# EAGLE design lcd (EAGLE 5.11)
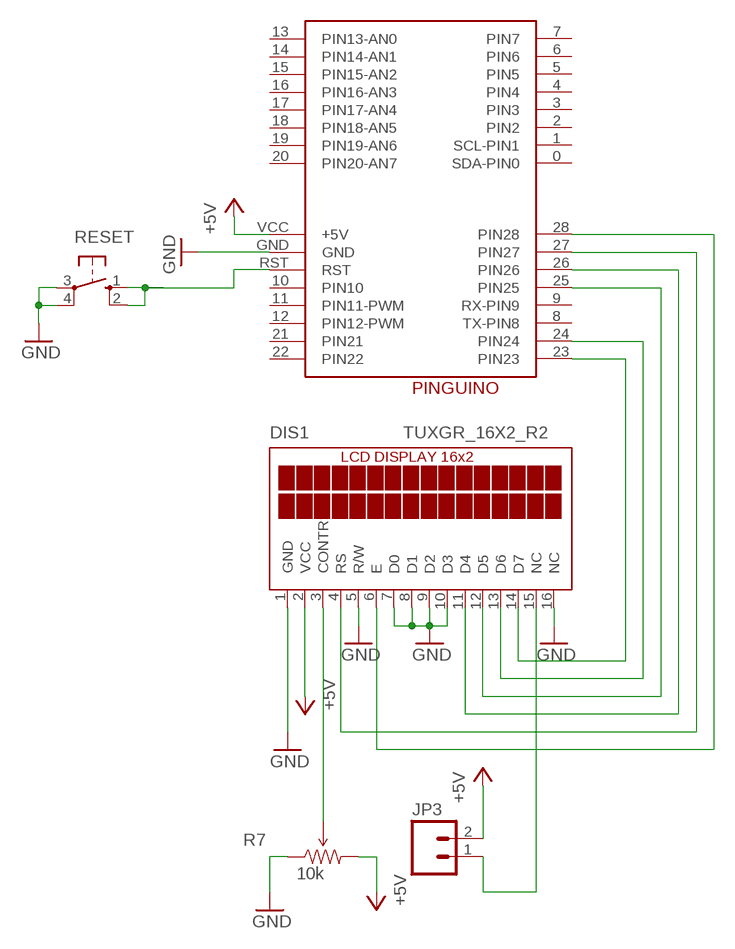
[diagram p0: schematic, sheet 1]

## Parts
DIS1  TUXGR_16X2_R2  [TUXGR_16X2_R2]
JP3  M02LOCK_LONGPADS  [1X02_LOCK_LONGPADS]
PINGUINO  PINGUINOBASE  PINGUINOBASEORIGINAL  [PINGUINOBASE]
R7  10k  TRIMPOTPTH  [TRIM_POT_PTH]
RESET  10-XX  [B3F-10XX]

## Nets
+5V: DIS1.2(VCC) JP3.2 PINGUINO.VCC(+5V) R7.3(CW)
GND: DIS1.1(GND) DIS1.5(R/W) DIS1.7(D0) DIS1.8(D1) DIS1.9(D2) DIS1.10(D3) DIS1.16(NC) PINGUINO.GND R7.1(CCW) RESET.3(P) RESET.4(P1)
N$1: DIS1.14(D7) PINGUINO.23(PIN23)
N$2: DIS1.13(D6) PINGUINO.24(PIN24)
N$3: DIS1.12(D5) PINGUINO.25(PIN25)
N$4: DIS1.11(D4) PINGUINO.26(PIN26)
N$9: DIS1.3(CONTR) R7.2(WIPER)
N$10: DIS1.4(RS) PINGUINO.27(PIN27)
N$11: DIS1.15(NC) JP3.1
N$12: DIS1.6(E) PINGUINO.28(PIN28)
RST: PINGUINO.RST RESET.1(S) RESET.2(S1)
Unconnected: PINGUINO.0(SDA-PIN0) PINGUINO.1(SCL-PIN1) PINGUINO.2(PIN2) PINGUINO.3(PIN3) PINGUINO.4(PIN4) PINGUINO.5(PIN5) PINGUINO.6(PIN6) PINGUINO.7(PIN7) PINGUINO.8(TX-PIN8) PINGUINO.9(RX-PIN9) PINGUINO.10(PIN10) PINGUINO.11(PIN11-PWM) PINGUINO.12(PIN12-PWM) PINGUINO.13(PIN13-AN0) PINGUINO.14(PIN14-AN1) PINGUINO.15(PIN15-AN2) PINGUINO.16(PIN16-AN3) PINGUINO.17(PIN17-AN4) PINGUINO.18(PIN18-AN5) PINGUINO.19(PIN19-AN6) PINGUINO.20(PIN20-AN7) PINGUINO.21(PIN21) PINGUINO.22(PIN22)

## Library data of the parts
DIS1 = display-lcd:TUXGR_16X2_R2: Tuxgraphics LCD display 16x2 characters reflective, without background light Source: tuxgr_12x2_r2.pdf; OC_FARNELL: unknown; OC_NEWARK: unknown
JP3 = SparkFun:M02: Header 2 Standard 2-pin 0.1" header. Use with straight break away headers (SKU : PRT-00116), right angle break away headers (PRT-00553), swiss pins (PRT-00743), machine pins (PRT-00117), and female headers (PRT-00115). Molex polarized connector foot print use with SKU : PRT-08233 with associated crimp pins and housings.
PINGUINO = PinguinoBase:PINGUINOBASE: Pinguino Base: Placa de desarrollo para Pinguino pic
R7 = SparkFun:TRIMPOT
RESET = switch-omron:10-XX: OMRON SWITCH; MPN: B3F-1000; OC_FARNELL: 176432; OC_NEWARK: 36M3542

## Board
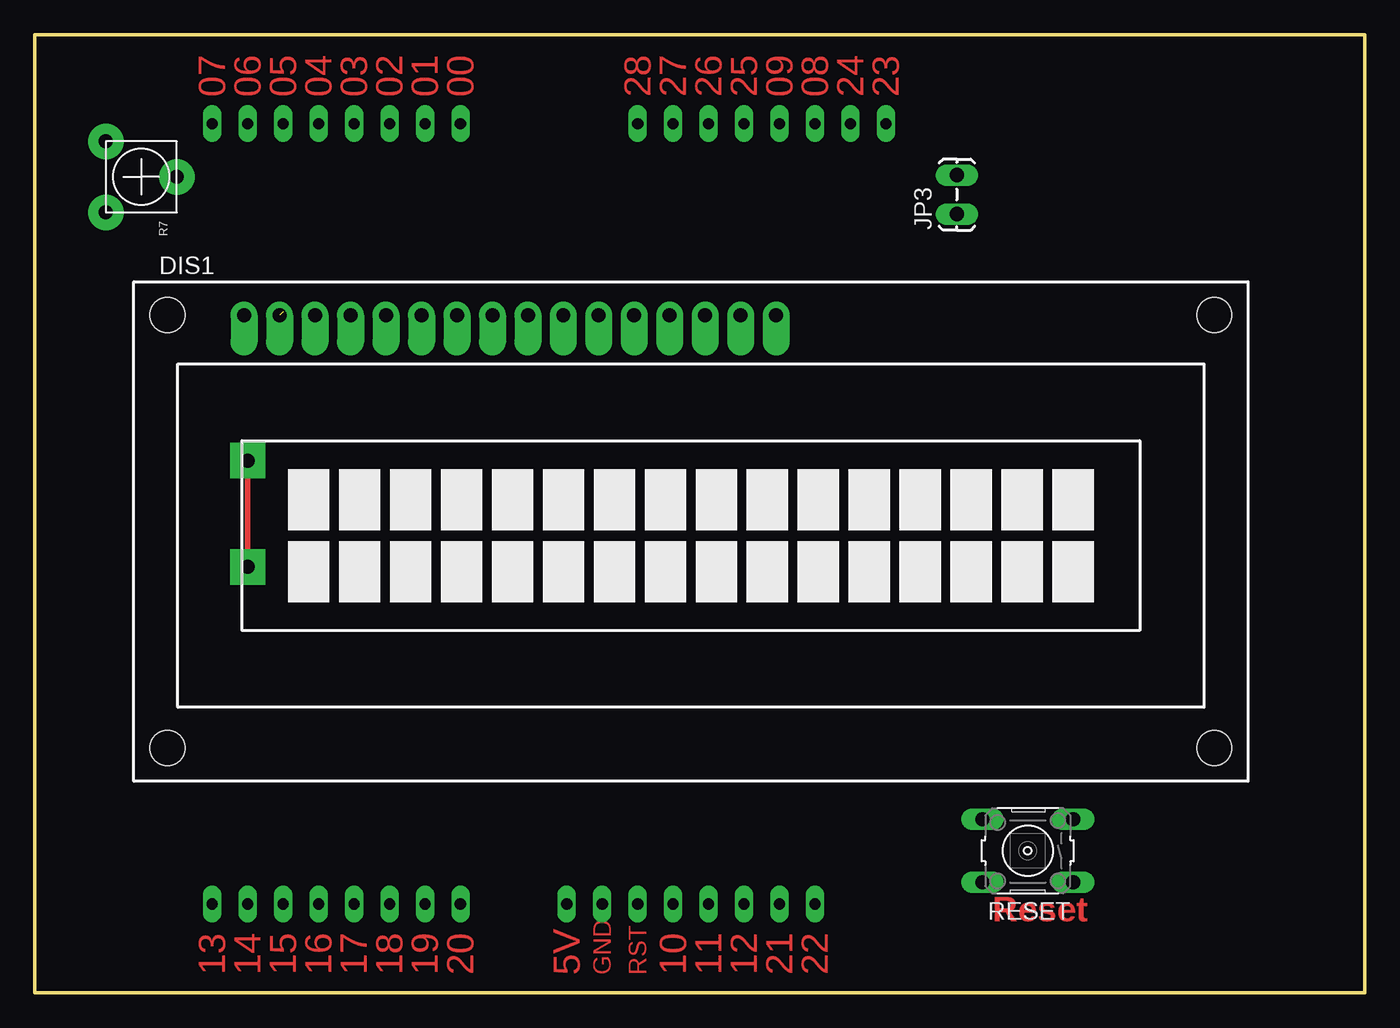
[diagram p1: board, top side]
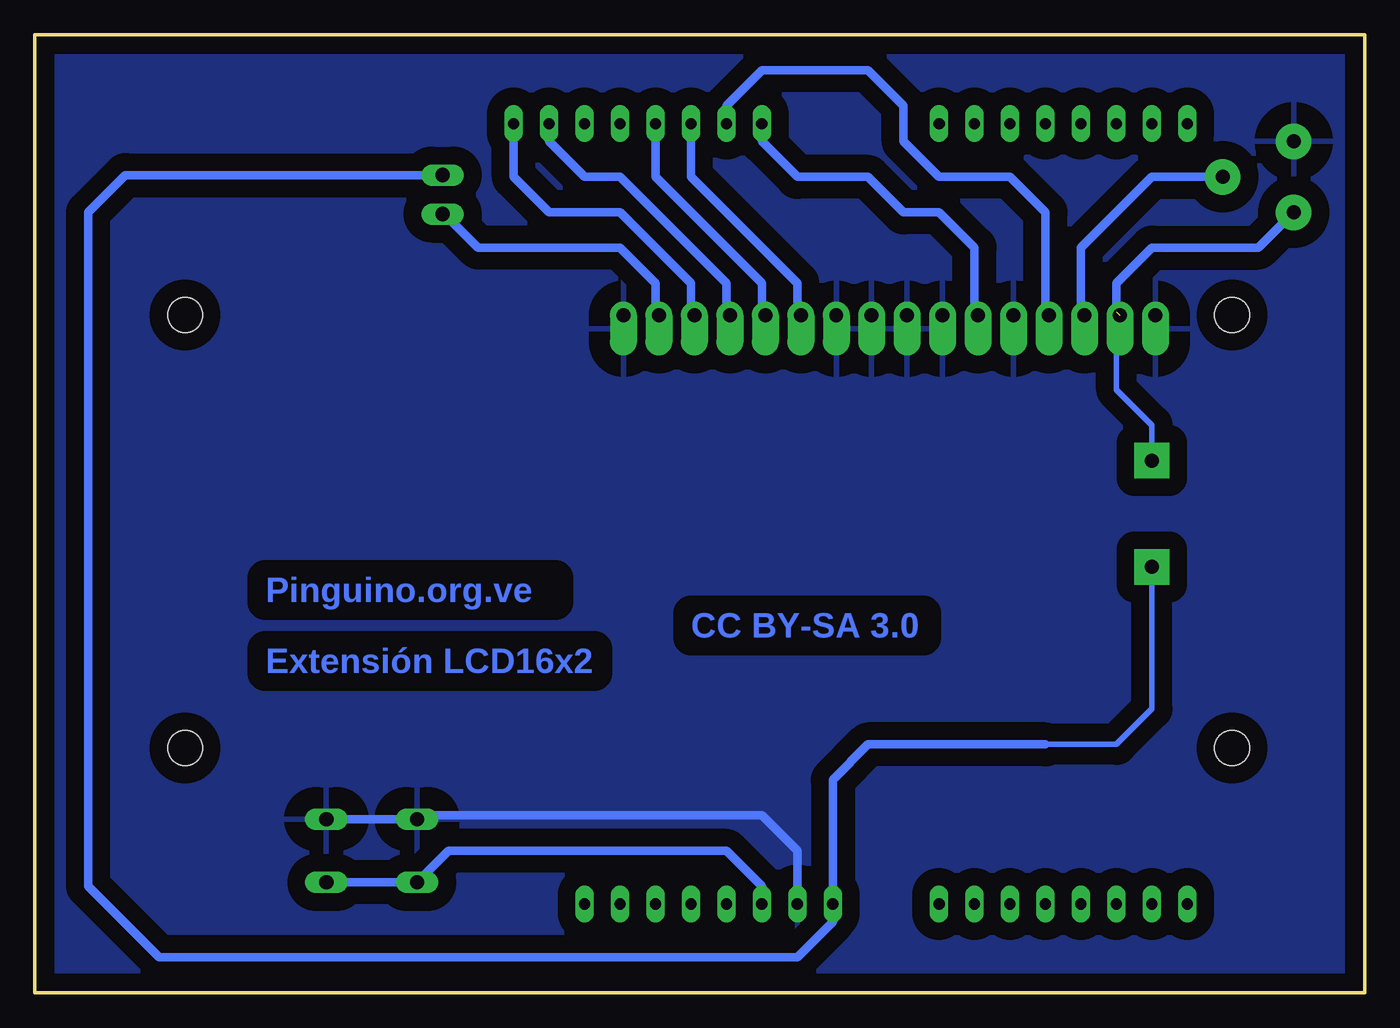
[diagram p2: board, bottom side, seen from below]

Size 95.25 x 68.58 mm. Coordinates in mm from the lower left corner, seen from the top.
Copper layers (1*16): Top 0.035mm / dielectric 1.5mm / Bottom 0.035mm
Design rules "default *": minimum track width 10mil, minimum drill 24mil, track to track 8mil, track to pad 8mil, pad to pad 8mil, via to via 8mil, smd to smd 8mil, copper to edge 40mil, drill to drill 8mil, minimum pad ring 10mil, minimum via ring 20mil, stop-mask expansion 4mil, vias tented up to drill 0mil, thermal gap 60mil

### Footprints (pad centres in the part's own frame; a part is rotated, then mirrored left to right if it is on the bottom)
TUXGR_16X2_R2 = drill 1 pad 1.93 offset: 1 -32,15.5; 2 -29.46,15.5; 3 -26.92,15.5; 4 -24.38,15.5; 5 -21.84,15.5; 6 -19.3,15.5; 7 -16.76,15.5; 8 -14.22,15.5; 9 -11.68,15.5; 10 -9.14,15.5; 11 -6.6,15.5; 12 -4.06,15.5; 13 -1.52,15.5; 14 1.02,15.5; 15 3.56,15.5; 16 6.1,15.5 | hole 2.5: -37.5,-15.5; 37.5,-15.5; -37.5,15.5; 37.5,15.5
1X02_LOCK_LONGPADS = drill 1.016 long: 1 -0.127,0; 2 2.667,0
PINGUINOBASE = drill 0.8 long: 0 64.77,6.35; 1 67.31,6.35; 2 69.85,6.35; 3 72.39,6.35; 4 74.93,6.35; 5 77.47,6.35; 6 80.01,6.35; 7 82.55,6.35; 8 39.37,6.35; 9 41.91,6.35; 10 49.53,62.23; 11 46.99,62.23; 12 44.45,62.23; 13 82.55,62.23; 14 80.01,62.23; 15 77.47,62.23; 16 74.93,62.23; 17 72.39,62.23; 18 69.85,62.23; 19 67.31,62.23; 20 64.77,62.23; 21 41.91,62.23; 22 39.37,62.23; 23 34.29,6.35; 24 36.83,6.35; 25 44.45,6.35; 26 46.99,6.35; 27 49.53,6.35; 28 52.07,6.35; GND 54.61,62.23; RST 52.07,62.23; VCC 57.15,62.23
TRIM_POT_PTH = drill 1 pad 2.54 round: 1 -2.54,-2.54; 2 0,2.54; 3 2.54,-2.54
B3F-10XX = drill 1.016 long: 1 -3.251,2.261; 2 3.251,2.261; 3 -3.251,-2.261; 4 3.251,-2.261

### Placement (x,y rotation side)
DIS1  46.99,33.02 0 top
JP3  66.04,55.88 90 top
PINGUINO  95.25,68.58 180 top
R7  7.62,58.42 270 top
RESET  71.12,10.16 180 top

### Tracks (layer width: path | path; a pad name or v marks a point on that pad's centre or on a via)
+5V  (via drill 1 pad 2.54)  (1 unrouted)
  Top 0.406: v15.24,30.48 v15.24,38.1
  Bottom 0.406: 22.86,17.78 17.78,17.78 15.24,20.32 v15.24,30.48 | v15.24,38.1 15.24,40.64 17.78,43.18 17.78,48.77
  Bottom 0.61: JP3.2 88.77,58.55 91.44,55.88 91.44,7.62 86.36,2.54 40.64,2.54 38.1,5.08 PINGUINO.VCC 38.1,15.24 35.56,17.78 22.86,17.78 | R7.3 7.62,53.34 15.24,53.34 17.78,50.8 17.78,48.77
GND
  Bottom 0.61: PINGUINO.GND 40.64,10.16 43.18,12.7 67.59,12.7 RESET.4 RESET.3
  pour Bottom (isolate 1.27): 0,0 95.25,0 95.25,68.58 0,68.58
N$1
  Bottom 0.61: PINGUINO.23 60.96,58.42 58.42,55.88 53.34,55.88 48.26,50.8 48.26,48.77 DIS1.14
N$2
  Bottom 0.61: PINGUINO.24 58.42,60.96 55.88,58.42 53.34,58.42 45.72,50.8 45.72,48.77 DIS1.13
N$3
  Bottom 0.61: PINGUINO.25 50.8,58.42 43.18,50.8 43.18,48.77 DIS1.12
N$4
  Bottom 0.61: PINGUINO.26 48.26,58.42 40.64,50.8 40.64,48.77 DIS1.11
N$9
  Bottom 0.61: R7.2 15.24,58.42 20.32,53.34 20.32,48.77 DIS1.3
N$10
  Bottom 0.61: PINGUINO.27 45.72,63.5 43.18,66.04 35.56,66.04 33.02,63.5 33.02,60.96 30.48,58.42 25.4,58.42 22.86,55.88 22.86,48.77 DIS1.4
N$11
  Bottom 0.61: JP3.1 65.91,55.75 63.5,53.34 53.34,53.34 50.8,50.8 50.8,48.77 DIS1.15
N$12
  Bottom 0.61: PINGUINO.28 43.18,60.96 40.64,58.42 35.56,58.42 33.02,55.88 30.48,55.88 27.94,53.34 27.94,48.77 DIS1.6
RST
  Bottom 0.61: RESET.1 RESET.2 65.61,10.16 45.72,10.16 43.18,7.62 PINGUINO.RST

### Text on the board
Top: Reset
Bottom: Pinguino.org.ve | CC BY-SA 3.0 | Extensión LCD16x2